# EAGLE design DisplayCard (EAGLE 7.2.0)
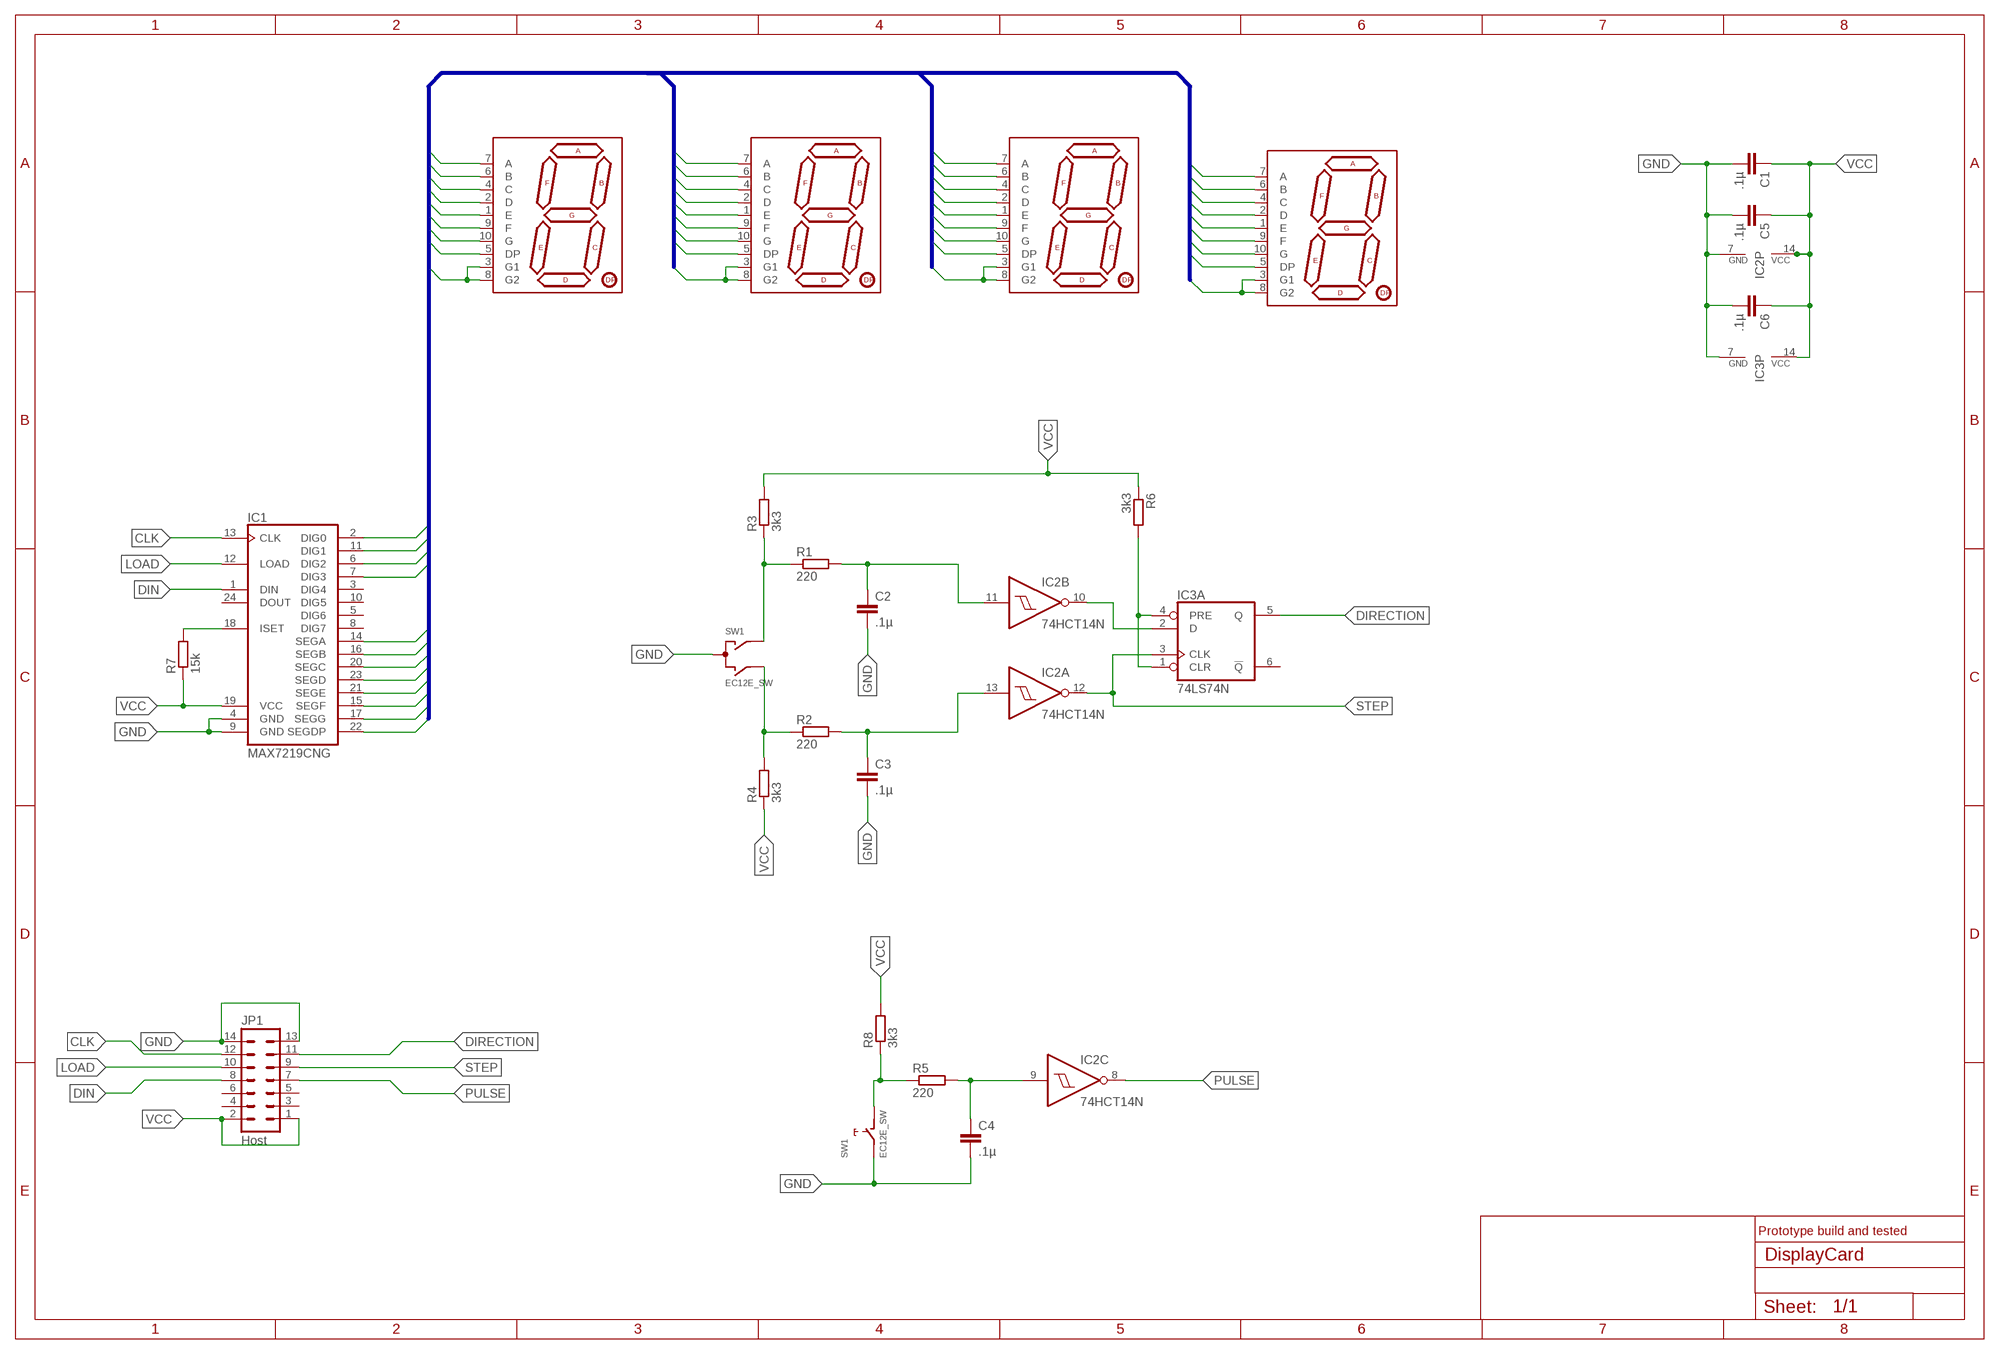
[diagram p0: schematic, sheet 1]

## Parts
C1  .1µ  C-EU025-024X044  [C025-024X044]
C2  .1µ  C-EU025-024X044  [C025-024X044]
C3  .1µ  C-EU025-024X044  [C025-024X044]
C4  .1µ  C-EU025-024X044  [C025-024X044]
C5  .1µ  C-EU025-024X044  [C025-024X044]
C6  .1µ  C-EU025-024X044  [C025-024X044]
DIGI4  7-SEGMENT-DISPLAYPTH  [7-SEGMENT-DISPLAY]
DIGIT1  7-SEGMENT-DISPLAYPTH  [7-SEGMENT-DISPLAY]
DIGIT2  7-SEGMENT-DISPLAYPTH  [7-SEGMENT-DISPLAY]
DIGIT3  7-SEGMENT-DISPLAYPTH  [7-SEGMENT-DISPLAY]
IC1  MAX7219CNG  [DIL24-3]
IC2  74HCT14N  [DIL14]
IC3  74LS74N  [DIL14]
JP1  Host  ML14L  [ML14L]
R1  220  R-EU_0204/7  [0204/7]
R2  220  R-EU_0204/7  [0204/7]
R3  3k3  R-EU_0204/7  [0204/7]
R4  3k3  R-EU_0204/7  [0204/7]
R5  220  R-EU_0204/7  [0204/7]
R6  3k3  R-EU_0204/7  [0204/7]
R7  15k  R-EU_0204/7  [0204/7]
R8  3k3  R-EU_0204/7  [0204/7]
SW1  EC12E_SW  [ALPS_EC12E_SW]

## Nets
A: DIGI4.7(A) DIGIT1.7(A) DIGIT2.7(A) DIGIT3.7(A) IC1.14(SEGA)
B: DIGI4.6(B) DIGIT1.6(B) DIGIT2.6(B) DIGIT3.6(B) IC1.16(SEGB)
C: DIGI4.4(C) DIGIT1.4(C) DIGIT2.4(C) DIGIT3.4(C) IC1.20(SEGC)
CLK: IC1.13(CLK) JP1.12
D: DIGI4.2(D) DIGIT1.2(D) DIGIT2.2(D) DIGIT3.2(D) IC1.23(SEGD)
D0: DIGIT1.3(G1) DIGIT1.8(G2) IC1.2(DIG0)
D1: DIGIT2.3(G1) DIGIT2.8(G2) IC1.11(DIG1)
D2: DIGIT3.3(G1) DIGIT3.8(G2) IC1.6(DIG2)
D3: DIGI4.3(G1) DIGI4.8(G2) IC1.7(DIG3)
DIN: IC1.1(DIN) JP1.8
DIRECTION: IC3.5(A:Q) JP1.11
DP: DIGI4.5(DP) DIGIT1.5(DP) DIGIT2.5(DP) IC1.22(SEGDP)
E: DIGI4.1(E) DIGIT1.1(E) DIGIT2.1(E) DIGIT3.1(E) IC1.21(SEGE)
ENC1: C2.1 IC2.11(B:I) R1.2
ENC2: C3.1 IC2.13(A:I) R2.2
F: DIGI4.9(F) DIGIT1.9(F) DIGIT2.9(F) DIGIT3.9(F) IC1.15(SEGF)
G: DIGI4.10(G) DIGIT1.10(G) DIGIT2.10(G) DIGIT3.5(DP) DIGIT3.10(G) IC1.17(SEGG)
GND [Supply]: C1.2 C2.2 C3.2 C4.2 C5.2 C6.2 IC1.4(GND) IC1.9(GND) IC2.7(P:GND) IC3.7(P:GND) JP1.13 JP1.14 SW1.C SW1.E
K: C4.1 IC2.9(C:I) R5.2
LOAD: IC1.12(LOAD) JP1.10
N$1: R1.1 R3.1 SW1.A
N$2: IC3.1(A:CLR) IC3.4(A:PRE) R6.2
N$4: R2.1 R4.2 SW1.B
N$5: R5.1 R8.1 SW1.D
N$6: IC2.10(B:O) IC3.2(A:D)
N$9: IC1.18(ISET) R7.2
PULSE: IC2.8(C:O) JP1.7
STEP: IC2.12(A:O) IC3.3(A:CLK) JP1.9
VCC [Supply]: C1.1 C5.1 C6.1 IC1.19(VCC) IC2.14(P:VCC) IC3.14(P:VCC) JP1.1 JP1.2 R3.2 R4.1 R6.1 R7.1 R8.2
Unconnected: IC1.3(DIG4) IC1.5(DIG6) IC1.8(DIG7) IC1.10(DIG5) IC1.24(DOUT) IC2.1(D:I) IC2.2(D:O) IC2.3(E:I) IC2.4(E:O) IC2.5(F:I) IC2.6(F:O) IC3.6(A:!Q) IC3.8(B:!Q) IC3.9(B:Q) IC3.10(B:PRE) IC3.11(B:CLK) IC3.12(B:D) IC3.13(B:CLR) JP1.3 JP1.4 JP1.5 JP1.6 SW1.GND1(G) SW1.GND2(G)

## Buses
SEG:A,B,C,D,E,F,G,DP,D0,D1,D2,D3

## Notes on the sheet
- Prototype build and tested

## Library data of the parts
C1 C5 C6 = resistor:C-EU: CAPACITOR, European symbol
C2-C4 = rcl:C-EU: CAPACITOR, European symbol
DIGI4 DIGIT1-DIGIT3 = SparkFun:7-SEGMENT-DISPLAY
IC1 = maxim-10:MAX7219*: Serially Interfaced, 8-Digit LED Display Drivers
IC2 = 74xx-eu:74*14: Hex schmitt trigger INVERTER
IC3 = 74xx-eu:74*74: Dual D type positive edge triggered FLIP FLOP, preset and clear
JP1 = con-ml:ML14L: HARTING
R1-R8 = resistor:R-EU_: RESISTOR, European symbol
SW1 = switch-alps:EC12E_SW: ALPS rotary Encoder EC12E series with switch

## Net classes
0 default: width 0.3 mm
1 Supply: width 0.762 mm

## Board
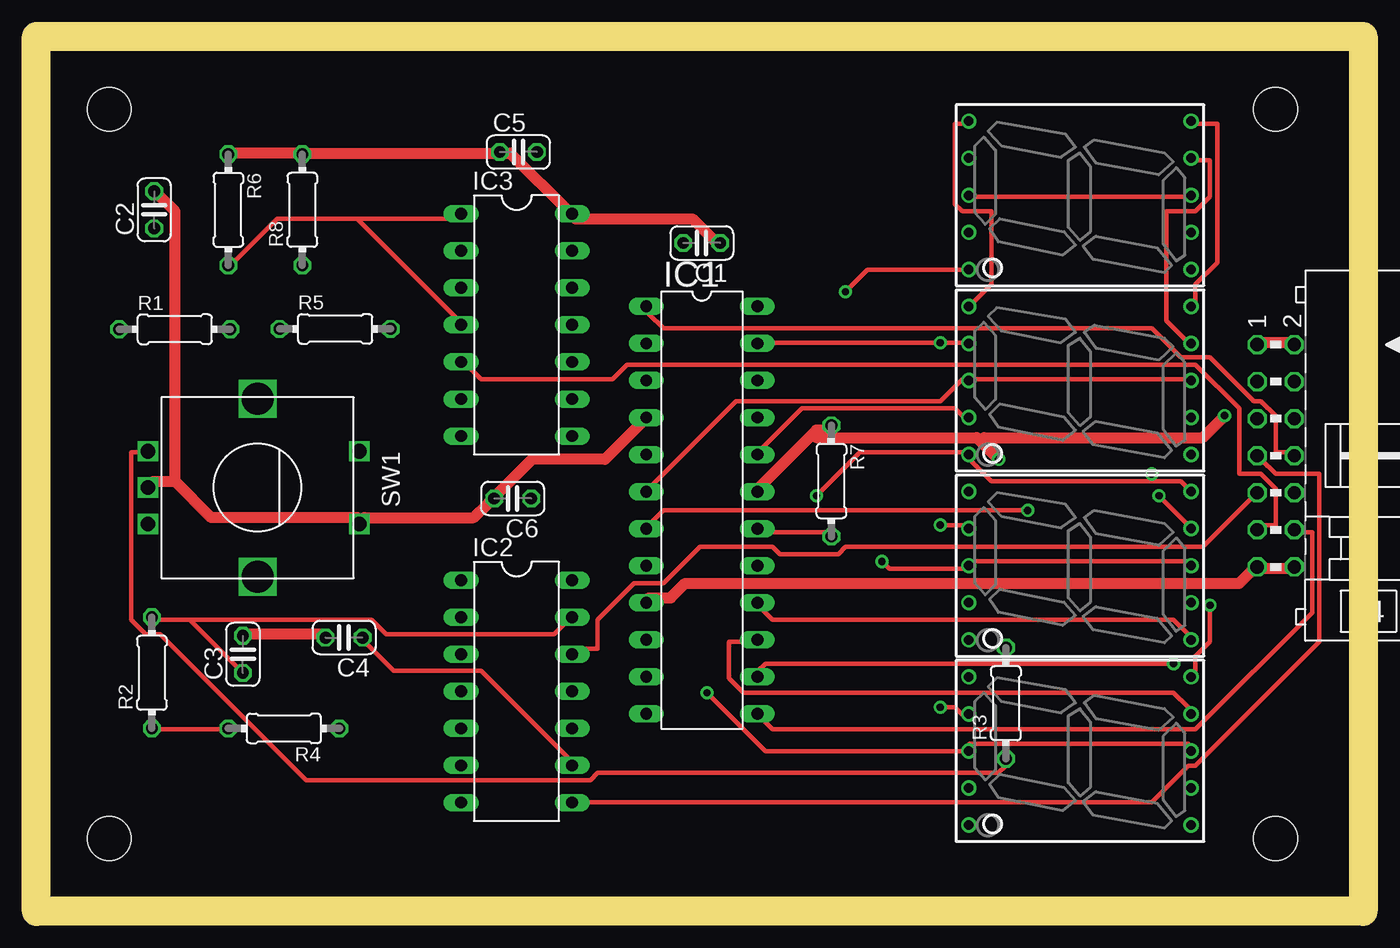
[diagram p1: board, top side]
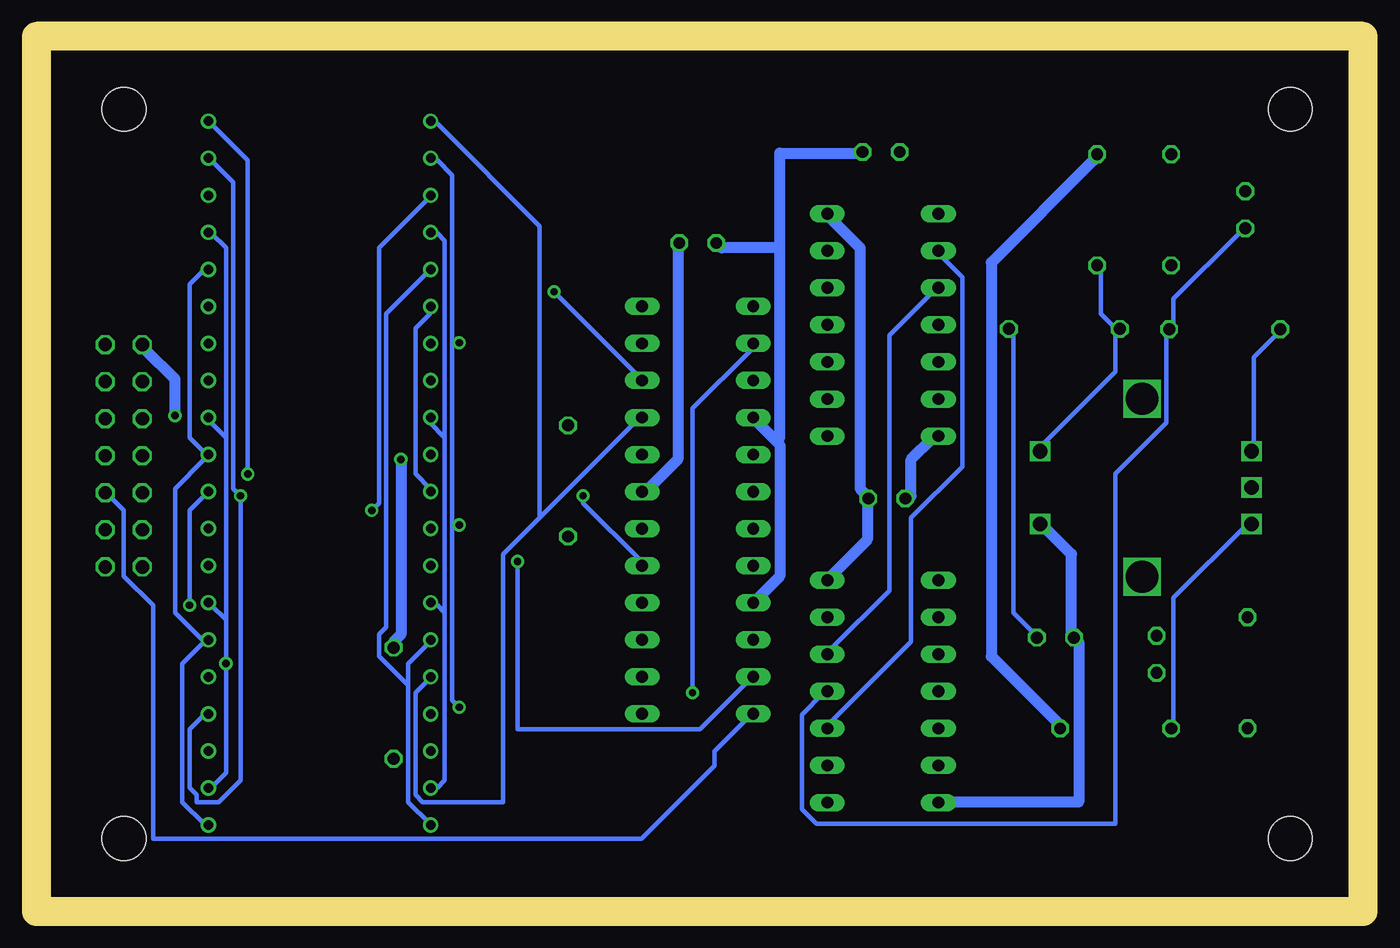
[diagram p2: board, bottom side, seen from below]

Size 91 x 60 mm. Coordinates in mm from the lower left corner, seen from the top.
Outline: 0,60 91,60 91,0 0,0 0,60
Copper layers (1*16): Top 0.035mm / dielectric 1.5mm / Bottom 0.035mm
Design rules "ZWILLING *": minimum track width 0.3mm, minimum drill 0.5mm, track to track 0.2mm, track to pad 0.2mm, pad to pad 0.15mm, via to via 0.2mm, smd to smd 0mil, copper to edge 0.2mm, drill to drill 0.2mm, minimum pad ring 0.2mm, minimum via ring 0.2mm, stop-mask expansion 0.1mm, vias tented up to drill 0mil, thermal gap 10mil
Holes 3 mm at 5,55 85,55 85,5 5,5

### Footprints (pad centres in the part's own frame; a part is rotated, then mirrored left to right if it is on the bottom)
C025-024X044 = drill 0.813 octagon: 1 -1.27,0; 2 1.27,0
7-SEGMENT-DISPLAY = drill 0.65: 1 -5.08,-7.62; 2 -2.54,-7.62; 3 0,-7.62; 4 2.54,-7.62; 5 5.08,-7.62; 6 5.08,7.62; 7 2.54,7.62; 8 0,7.62; 9 -2.54,7.62; 10 -5.08,7.62
DIL24-3 = drill 0.813 long: 1 -13.97,-3.81; 2 -11.43,-3.81; 3 -8.89,-3.81; 4 -6.35,-3.81; 5 -3.81,-3.81; 6 -1.27,-3.81; 7 1.27,-3.81; 8 3.81,-3.81; 9 6.35,-3.81; 10 8.89,-3.81; 11 11.43,-3.81; 12 13.97,-3.81; 13 13.97,3.81; 14 11.43,3.81; 15 8.89,3.81; 16 6.35,3.81; 17 3.81,3.81; 18 1.27,3.81; 19 -1.27,3.81; 20 -3.81,3.81; 21 -6.35,3.81; 22 -8.89,3.81; 23 -11.43,3.81; 24 -13.97,3.81
DIL14 = drill 0.813 long: 1 -7.62,-3.81; 2 -5.08,-3.81; 3 -2.54,-3.81; 4 0,-3.81; 5 2.54,-3.81; 6 5.08,-3.81; 7 7.62,-3.81; 8 7.62,3.81; 9 5.08,3.81; 10 2.54,3.81; 11 0,3.81; 12 -2.54,3.81; 13 -5.08,3.81; 14 -7.62,3.81
ML14L = drill 0.914 octagon: 1 -7.62,-1.27; 2 -7.62,1.27; 3 -5.08,-1.27; 4 -5.08,1.27; 5 -2.54,-1.27; 6 -2.54,1.27; 7 0,-1.27; 8 0,1.27; 9 2.54,-1.27; 10 2.54,1.27; 11 5.08,-1.27; 12 5.08,1.27; 13 7.62,-1.27; 14 7.62,1.27
0204/7 = drill 0.813 octagon: 1 -3.81,0; 2 3.81,0
ALPS_EC12E_SW = drill 1 square: A -2.5,-7.5; B 2.5,-7.5; C 0,-7.5; D -2.5,7; E 2.5,7 | drill 2.2 square: GND1 -6.1,0; GND2 6.1,0

### Placement (x,y rotation side)
C1  45.64,45.84 180 top
C2  8.08,48.11 90 top
C3  14.16,17.63 90 top
C4  21.1,18.78 180 top
C5  33.06,52.08 0 top
C6  32.67,28.32 180 top
DIGI4  71.58,49.11 270 top
DIGIT1  71.58,11.01 270 top
DIGIT2  71.58,23.71 270 top
DIGIT3  71.58,36.41 270 top
IC1  45.64,27.52 270 top
IC2  32.94,15.09 270 top
IC3  32.94,40.22 270 top
JP1  85.01,31.25 270 top
R1  9.49,39.92 0 top
R2  7.92,16.37 90 top
R3  66.5,14.28 90 top
R4  16.97,12.55 180 top
R5  20.49,39.95 0 top
R6  13.16,48.11 270 top
R7  54.53,29.52 270 top
R8  18.24,48.11 90 top
SW1  15.16,29.06 270 top

### Tracks (layer width: path | path; a pad name or v marks a point on that pad's centre or on a via)
A  (via drill 0.5)
  Top 0.3: v78,17 50,17 49.5,16.5 IC1.14
  Bottom 0.3: 78,20 v78,17 78,9.5 79,8.5 DIGIT1.7 | 78,20 79,21 DIGIT2.7 | 78,32.5 79,33.5 DIGIT3.7 | 78,20 78,32.5 | 78,32.5 78,45.5 79,46.5 DIGI4.7
B
  Top 0.3: IC1.16 49.5,21 50.5,20 78,20 79,19 DIGIT2.6
  Bottom 0.3: DIGI4.6 79.5,44 80.5,43 80.5,32.5 79.5,31.5 DIGIT3.6 79.5,31 81.5,29 81.5,20.5 79.5,18.5 | 79.5,18.5 81,17 81,7.5 79.5,6 DIGIT1.6 | 79.5,18.5 DIGIT2.6
C
  Top 0.3: IC1.20 49.5,31.5 52.5,34.5 63,34.5 63.5,34 DIGIT3.4
  Bottom 0.3: 63,20.5 63,9 63.5,8.5 DIGIT1.4 | 63,20.5 63.5,21 DIGIT2.4 | 63,32.5 64,33.5 DIGIT3.4 | 63,20.5 63,32.5 | 63,32.5 63,46 63.5,46.5 DIGI4.4
CLK
  Top 0.3: IC1.13 50.5,12.5 79.5,12.5 87.5,20.5 87.5,26 86.5,26 JP1.12
D  (via drill 0.5)
  Top 0.3: DIGIT3.2 63.5,39 v62,39 49.5,39 IC1.23 | v62,14 63,14 63.5,13.5 DIGIT1.2 | v62,26.5 63.5,26.5 DIGIT2.2
  Bottom 0.3: v62,14 62.5,14.5 62.5,26.5 | 62.5,39 62.5,50.5 63.5,51.5 DIGI4.2 | 62.5,39 62.5,26.5 | 62.5,26.5 v62,26.5 | 62.5,39 v62,39
D0  (via drill 0.5)
  Top 0.3: DIGIT1.8 79,11.5 64,11.5 DIGIT1.3 63.5,11 50,11 v46,15
  Bottom 0.3: v46,15 46,34.5 42,38.5 IC1.2
D1  (via drill 0.5)
  Top 0.3: DIGIT2.8 79,24 64,24 DIGIT2.3 63.5,23.5 58.5,23.5 v58,24
  Bottom 0.3: v58,24 58,12.5 45.5,12.5 42,16 IC1.11
D2
  Top 0.3: DIGIT3.8 79,36.5 64,36.5 DIGIT3.3 63.5,36.5 62,35 48,35 42,29 IC1.6
D3  (via drill 0.5)
  Top 0.3: DIGI4.3 64,49 79,49 DIGI4.8 | v68,27.5 43,27.5 42,26.5 IC1.7
  Bottom 0.3: v68,27.5 67.5,28 67.5,45.5 64,49 DIGI4.3
DIN
  Top 0.3: IC1.1 42,41 43,40 76.5,40 78.5,38 80.5,38 83.5,35 84,35 85,34 85,31.5 86,31.5 JP1.8
DIRECTION
  Top 0.3: IC3.5 29.5,37.5 30.5,36.5 39.5,36.5 40.5,37.5 79.5,37.5 82.5,34.5 82.5,30 84,30 85,29 85,26.5 84,26.5 JP1.11
DP  (via drill 0.5)
  Top 0.3: v55.5,42.5 57,44 63.5,44 DIGI4.5
  Bottom 0.3: 65.5,15.5 65.5,17 64,18.5 DIGIT2.5 | 65.5,15.5 65.5,7.5 64,6 DIGIT1.5 | 65.5,15.5 67.5,17.5 67.5,19 67,19.5 67,41 64,44 DIGI4.5 | v55.5,42.5 49.5,36.5 IC1.22
E
  Top 0.3: DIGIT3.1 64,41.5 65.5,43 65.5,48 63.5,48 63,48.5 63,54 63.5,54 DIGI4.1
  Bottom 0.3: DIGIT2.1 64,29 65,30 65,40 64,41 DIGIT3.1 | 56.5,27 49.5,34 IC1.21 | 56.5,27 59,24.5 59,7.5 64.5,7.5 65,8 65,15 64,16 DIGIT1.1 | 56.5,27 56.5,47 63.5,54 DIGI4.1
ENC1
  Bottom 0.3: IC2.11 37,15 38.5,13.5 38.5,7 37.5,6 17,6 17,30 13.5,33.5 13.5,39.5 R1.2 13,40 13,42 8.5,46.5 C2.1
ENC2
  Top 0.3: 10.5,20 14,16.5 C3.1 | 10.5,20 8,20 R2.2 | 10.5,20 23,20 24,19 35.5,19 36.5,20 IC2.13
F  (via drill 0.5)
  Top 0.3: v77,28.5 79,26.5 DIGIT2.9 | DIGIT3.9 79,39 77.5,40.5 77.5,48 79.5,48 80.5,49 80.5,51.5 79.5,51.5 DIGI4.9 | DIGIT1.9 79,14 78,15 48.5,15 47.5,16 47.5,18.5 49,18.5 IC1.15
  Bottom 0.3: DIGI4.9 79,51.5 77.5,50 77.5,29 v77,28.5 77,9 78.5,7.5 80,7.5 80,8 80.5,8.5 80.5,12.5 79.5,13.5 DIGIT1.9
G  (via drill 0.5)
  Top 0.3: DIGIT3.10 79.5,41.5 79.5,43 81,44.5 81,54 79.5,54 DIGI4.10 | v80.5,21 80.5,18.5 79.5,17.5 79.5,16.5 DIGIT1.10 | 76.5,29.5 78.5,29.5 79,29 DIGIT2.10 | 76.5,29.5 65.5,29.5 64,31 DIGIT3.5 63.5,31.5 56.5,31.5 v53.5,28.5 | 76.5,29.5 v76.5,30
  Bottom 0.3: v80.5,21 80.5,27.5 79.5,28.5 DIGIT2.10 | v53.5,28.5 53.5,28 49.5,24 IC1.17 | v76.5,30 76.5,51.5 79,54 DIGI4.10
GND
  Top 0.762: 9.5,29.5 9.5,48 8.5,49 C2.2 | 9.5,29.5 8,29.5 SW1.C | C3.2 14.5,19 19.5,19 C4.2 | 9.5,29.5 12,27 22,27 SW1.E 22.5,27 30,27 31,28 C6.2 31.5,28.5 34,31 39,31 41.5,33.5 IC1.4 | JP1.14 86,23.5 84,23.5 JP1.13 83.5,23.5 82.5,22.5 44.5,22.5 43.5,21.5 42,21.5 IC1.9
  Bottom 0.762: IC3.7 29.5,32.5 31,31 31,28.5 C6.2 | IC2.7 29,7.5 19.5,7.5 19.5,18.5 C4.2 20,19 20,24.5 22,26.5 SW1.E | IC1.9 40,23 40,32 40.25,32.25 | 40.25,32.25 41.5,33.5 IC1.4 | 40,45.5 44,45.5 C1.2 | 40,45.5 40,32.5 40.25,32.25 | 40,45.5 40,52 34.5,52 C5.2
K
  Top 0.3: IC2.9 36.5,10.5 30.5,16.5 24.5,16.5 22.5,18.5 C4.1
  Bottom 0.3: C4.1 22.5,19 24,20.5 24,39.5 R5.2
LOAD
  Bottom 0.3: IC1.12 42,13.5 44.5,11 44.5,10 49.5,5 83,5 83,21 85,23 85,27.5 86,28.5 JP1.10
N$1
  Top 0.3: R3.1 66.5,10 66,9.5 38.5,9.5 38,9 18.5,9 8.5,19 7.5,19 6.5,20 6.5,31.5 7.5,31.5 SW1.A
  Bottom 0.3: R1.1 6,39.5 7.5,38 7.5,32 SW1.A
N$2
  Top 0.3: 22,47.5 29,47.5 IC3.1 | 22,47.5 16.5,47.5 13.5,44.5 R6.2 | 22,47.5 29,40.5 IC3.4
N$4
  Top 0.3: R4.2 13,12.5 8,12.5 R2.1
  Bottom 0.3: SW1.B 8,26.5 13,21.5 13,13 R4.2
N$5
  Bottom 0.3: R8.1 18,44 18,41 17,40 R5.1 17,39.5 17,37 22,32 SW1.D
N$6
  Bottom 0.3: IC2.10 36.5,13 31,18.5 31,27 27.5,30.5 27.5,43.5 29,45 IC3.2
N$9
  Top 0.3: IC1.18 49.5,26 54.5,26 R7.2
PULSE
  Top 0.3: IC2.8 37,7.5 76.5,7.5 79,10 79.5,10 88,18.5 88,30 85,30 84,31 JP1.7
STEP
  Top 0.3: JP1.9 83.5,28.5 80,25 55.5,25 55,24.5 51,24.5 50.5,25 45.5,25 43,22.5 41,22.5 38.5,20 38.5,18 37,18 IC2.12
  Bottom 0.3: IC2.12 36.5,18 32.5,22 32.5,39.5 29.5,42.5 IC3.3
VCC  (via drill 0.5)
  Top 0.762: JP1.1 84,39 86,39 JP1.2 | 53.25,32.75 53.5,33 54.5,33 R7.1 | 53.25,32.75 49.5,29 IC1.19 | 64.75,32.25 64.5,32.5 53.5,32.5 53.25,32.75 | 64.75,32.25 v66,31 | v81.5,34 80,32.5 65,32.5 64.75,32.25 | C1.1 46.5,46 45,47.5 37,47.5 IC3.14 36.5,48 32.5,52 32,52 C5.1 31.5,52 18.5,52 R8.2 18,52 13.5,52 R6.1
  Bottom 0.762: v66,31 66,19 66.5,18.5 R3.2 | v81.5,34 81.5,36.5 83.5,38.5 JP1.1 | IC2.14 36.5,23 34,25.5 34,28 C6.1 34,28.5 34.5,29 34.5,45.5 36.5,47.5 IC3.14 | R4.1 21,13 25.5,17.5 25.5,44.5 18.5,51.5 R8.2 | IC1.19 49,29 47,31 47,45.5 C1.1